# EAGLE schematic Training1 (EAGLE 7.6.0)
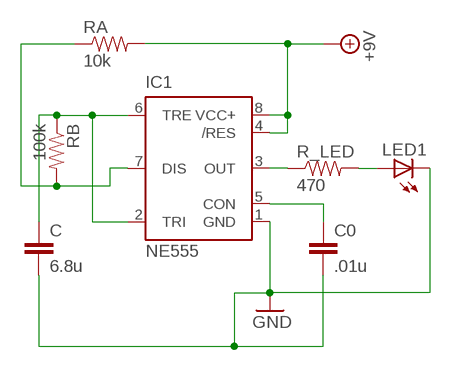
[diagram p0: schematic, sheet 1]

## Parts
C  6.8u  CAPPTH  [CAP-PTH-SMALL]
C0  .01u  CAPPTH  [CAP-PTH-SMALL]
IC1  NE555  [DIL-08]
LED1  LED3MM  [LED3MM]
R_LED  470  RESISTORPTH-1/4W  [AXIAL-0.4]
RA  10k  RESISTORPTH-1/4W  [AXIAL-0.4]
RB  100k  RESISTORPTH-1/4W  [AXIAL-0.4]

## Nets
+9V: IC1.4(/RES) IC1.8(VCC+) RA.P$2
GND: C0.2 C.2 IC1.1(GND) LED1.K(C)
N$1: C0.1 IC1.5(CON)
N$2: C.1 IC1.2(TRI) IC1.6(TRE) RB.P$1
N$3: IC1.7(DIS) RA.P$1 RB.P$2
N$4: LED1.A R_LED.P$2
N$5: IC1.3(OUT) R_LED.P$1

## Library data of the parts
C C0 = SparkFun-Capacitors:CAP: Capacitor Standard 0603 ceramic capacitor, and 0.1" leaded capacitor.
IC1 = st-microelectronics:NE555: General purpose bipolar Timer; MF: Arrow Electronics; MPN: NE555N; OC_FARNELL: 1467742; OC_NEWARK: 89K1486
LED1 = adafruit:LED: LED OSRAM: - CHIPLED LG R971, LG N971, LY N971, LG Q971, LY Q971, LO R971, LY R971 LH N974, LH R974 LS Q976, LO Q976, LY Q976 LO Q996 - Hyper CHIPLED LW Q18S LB Q993, LB Q99A, LB R99A - SideLED LS A670, LO A670, LY A670, LG A670, LP A670 LB A673, LV A673, LT A673, LW A673 LH A674 LY A675 LS A676, LA A676, LO A676, LY A676, LW A676 LS A679, LY A679, LG A679 - Hyper Micro SIDELED® LS Y876, LA Y876, LO Y876, LY Y876 LT Y87S - SmartLED LW L88C, LW L88S LB L89C, LB L89S, LG L890 LS L89K, LO L89K, LY L89K LS L896, LA L896, LO L896, LY L896 - TOPLED LS T670, LO T670, LY T670, LG T670, LP T670 LSG T670, LSP T670, LSY T670, LOP T670, LYG T670 LG T671, LOG T671, LSG T671 LB T673, LV T673, LT T673, LW T673 LH T674 LS T676, LA T676, LO T676, LY T676, LB T676, LH T676, LSB T676, LW T676 LB T67C, LV T67C, LT T67C, LS T67K, LO T67K, LY T67K, LW E67C LS E67B, LA E67B, LO E67B, LY E67B, LB E67C, LV E67C, LT E67C LW T67C LS T679, LY T679, LG T679 LS T770, LO T770, LY T770, LG T770, LP T770 LB T773, LV T773, LT T773, LW T773 LH T774 LS E675, LA E675, LY E675, LS T675 LS T776, LA T776, LO T776, LY T776, LB T776 LHGB T686 LT T68C, LB T68C - Hyper Mini TOPLED® LB M676 - Mini TOPLED Santana® LG M470 LS M47K, LO M47K, LY M47K Source: http://www.osram.convergy.de/
R_LED RA RB = SparkFun-Passives:RESISTOR: Resistor Basic schematic elements and footprints for 0603, 1206, and PTH resistors.